# Altium schematic sheet TSAL_Control.SchDoc
size A4; SheetNumber: 1; SheetTotal: 1; SPICEModelCacheMUSAZMGH: <root> / <DocumentId>MUSAZMGH</DocumentId> / </root>
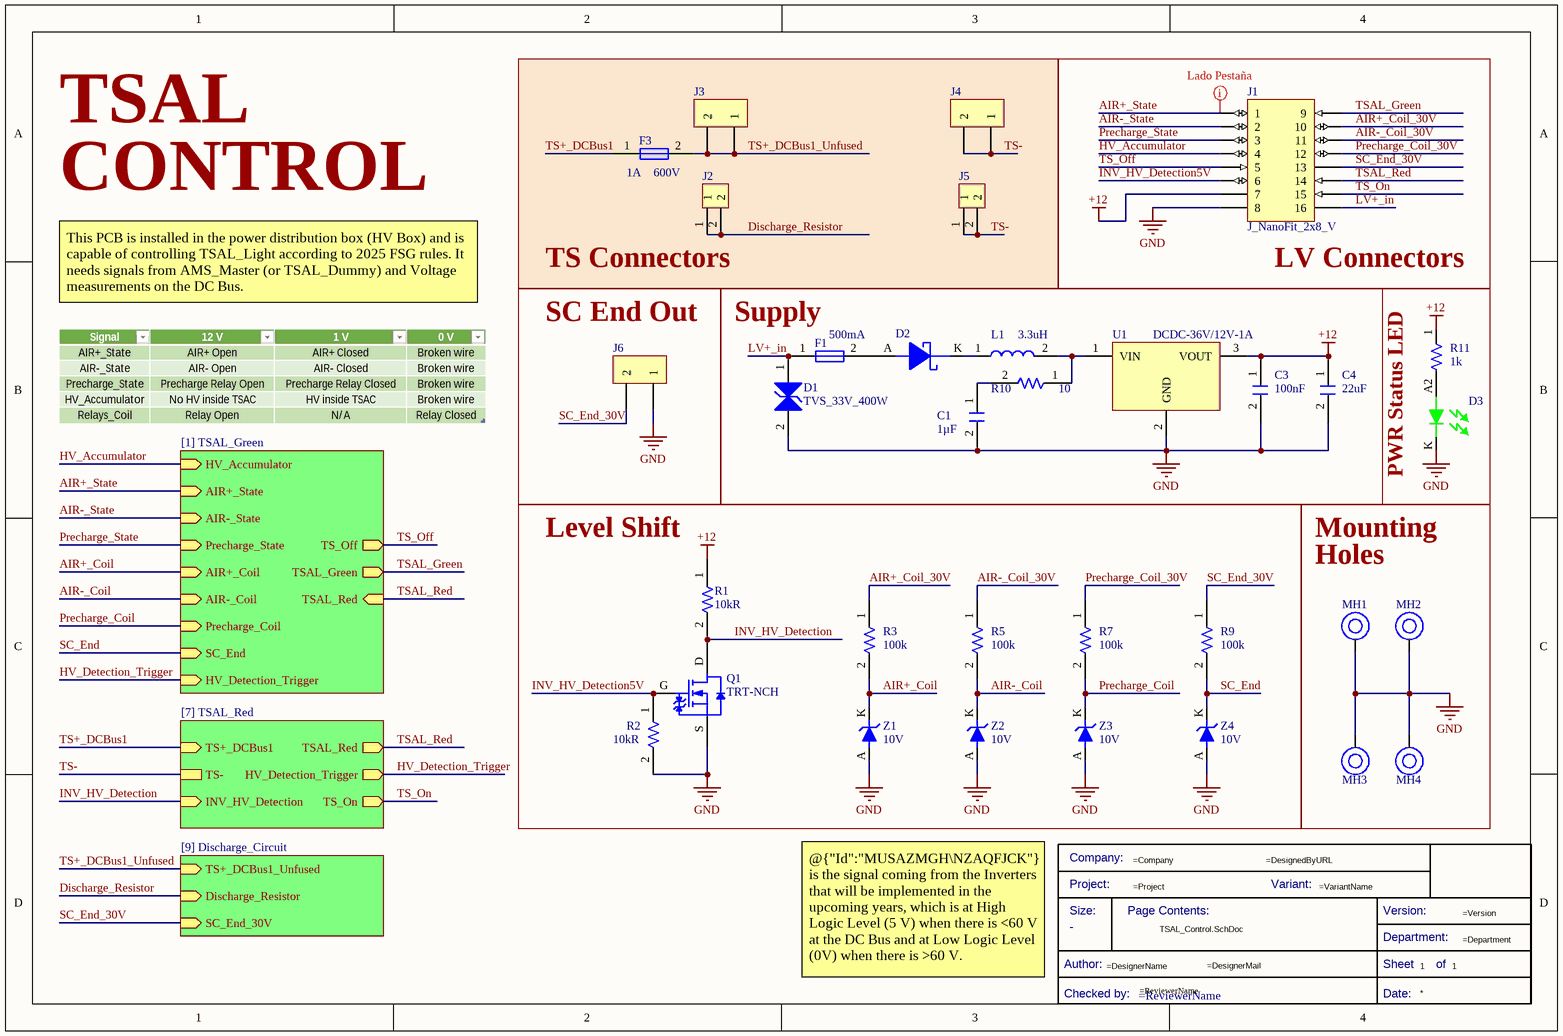
[diagram p0: TSAL_Control.SchDoc]

## Parts
*  Title Block_template  (value not drawn)  (graphical)
C1  value 1µF  [FP-CL31-IPC_A]  (hidden comment: C1u-50V-1206)
C3  value 100nF  [C1206FNPC-RW]  (hidden comment: C100n-25V-1206FNPC-X7R)
C4  Capacitance: 22uF  [WCAP-CSGP_1210_L3.2W2.5H2.5]  (hidden comment: C22u-25V-1210)
D1  TVS_33V_400W  [WE-TVSP_DO-214AC_Bidirectional]
D2  DSC-0.5/30-SOD123  [DSC-SOD123]  (value not drawn)
D3  LEDGS-0805-450  [LED_0805_WE]  (value not drawn)
F1  Current Rating: 500mA  [0805]  (hidden comment: MFU0805FF00500P500)
F3  Current Rating: 1A  Voltage Rating (DC): 600V  [Fuse_485001]  (hidden comment: Fuse_1A_600V)
J1  J_NanoFit_2x8_V  [J_NanoFit_2x8_V]
J2  J_MicroFit_2x1  [J_MicroFit_2x1]  (value not drawn)
J3  J_NanoFit_1x2  [FP-105309-1102-MFG]  (value not drawn)
J4  J_NanoFit_1x2  [FP-105309-1102-MFG]  (value not drawn)
J5  J_MicroFit_2x1  [J_MicroFit_2x1]  (value not drawn)
J6  J_NanoFit_1x2  [FP-105309-1102-MFG]  (value not drawn)
L1  3.3uH  [WE-PD_7345]
MH1  Mounting_Hole_M3  [Mounting_Hole_M3]  (value not drawn)
MH2  Mounting_Hole_M3  [Mounting_Hole_M3]  (value not drawn)
MH3  Mounting_Hole_M3  [Mounting_Hole_M3]  (value not drawn)
MH4  Mounting_Hole_M3  [Mounting_Hole_M3]  (value not drawn)
Q1  TRT-NCH  [TRT-NCH-3/35-CPH]
R1  10kR  [R0805FTK]
R2  value 10kR  [R0805FTK]  (hidden comment: R10k-0805FTK)
R3  value 100k  [RESC2013X70X40NL20T20]  (hidden comment: R100k-0805)
R5  value 100k  [RESC2013X70X40NL20T20]  (hidden comment: R100k-0805)
R7  value 100k  [RESC2013X70X40NL20T20]  (hidden comment: R100k-0805)
R9  value 100k  [RESC2013X70X40NL20T20]  (hidden comment: R100k-0805)
R10  Resistance: 10  [0805]  (hidden comment: R10_0805_0.25W)
R11  value 1k  [0805]  (hidden comment: R1K-0805-0.5W)
U1  DCDC-36V/12V-1A  [WPME-FDSM_SIP-3_L11.6W8H10.4]
Z1  Zener Voltage: 10V  [DSC-SOD123]  (hidden comment: DZ-10V/75-SOD-123)
Z2  Zener Voltage: 10V  [DSC-SOD123]  (hidden comment: DZ-10V/75-SOD-123)
Z3  Zener Voltage: 10V  [DSC-SOD123]  (hidden comment: DZ-10V/75-SOD-123)
Z4  Zener Voltage: 10V  [DSC-SOD123]  (hidden comment: DZ-10V/75-SOD-123)

## Blocks framed on the sheet
TS Connectors: F3 J2-J5
LV Connectors: J1
Supply: C1 C3 C4 D1 D2 F1 L1 R10 U1
PWR Status LED: D3 R11
Level Shift: Q1 R1-R3 R5 R7 R9 Z1-Z4

## Sub-sheets
Discharge_circuit = [9] Discharge_Circuit: Discharge_Resistor (in), SC_End_30V (in), TS+_DCBus1_Unfused (in)
TSAL Green = [1] TSAL_Green: HV_Accumulator (in), AIR+_State (in), Precharge_State (in), AIR+_Coil (in), AIR-_Coil (in), Precharge_Coil (in), SC_End (in), TS_Off (out), TSAL_Green (out), AIR-_State (in), HV_Detection_Trigger (in), TSAL_Red (in)
TSAL Red = [7] TSAL_Red: TS+_DCBus1 (in), TS_On (out), INV_HV_Detection (in), TSAL_Red (out), TS-, HV_Detection_Trigger (out)

## Nets
+12: C3.1 C4.1 J1.7 R1.1 R11.1 U1.3(VOUT)
GND: C1.2 C3.2 C4.2 D1.2 D3.K J1.8 J6.1 MH1.1 MH2.1 MH3.1 MH4.1 Q1.S R2.2 U1.2(GND) Z1.A Z2.A Z3.A Z4.A
AIR+_Coil: R3.2 Z1.K ; sheet TSAL Green/AIR+_Coil
AIR+_Coil_30V: J1.10 R3.1
AIR+_State: J1.1 ; sheet TSAL Green/AIR+_State
AIR-_Coil: R5.2 Z2.K ; sheet TSAL Green/AIR-_Coil
AIR-_Coil_30V: J1.11 R5.1
AIR-_State: J1.2 ; sheet TSAL Green/AIR-_State
Discharge_Resistor: J2.1 J2.2 ; sheet Discharge_circuit/Discharge_Resistor
HV_Accumulator: J1.4 ; sheet TSAL Green/HV_Accumulator
HV_Detection_Trigger: sheet TSAL Green/HV_Detection_Trigger, sheet TSAL Red/HV_Detection_Trigger
INV_HV_Detection: Q1.D R1.2 ; sheet TSAL Red/INV_HV_Detection
INV_HV_Detection5V: J1.6 Q1.G R2.1
LV+_in: D1.1 F1.1 J1.16
Precharge_Coil: R7.2 Z3.K ; sheet TSAL Green/Precharge_Coil
Precharge_Coil_30V: J1.12 R7.1
Precharge_State: J1.3 ; sheet TSAL Green/Precharge_State
SC_End: R9.2 Z4.K ; sheet TSAL Green/SC_End
SC_End_30V: J1.13 J6.2 R9.1 ; sheet Discharge_circuit/SC_End_30V
TS+_DCBus1: F3.1 ; sheet TSAL Red/TS+_DCBus1
TS+_DCBus1_Unfused: F3.2 J3.1 J3.2 ; sheet Discharge_circuit/TS+_DCBus1_Unfused
TS-: J4.1 J4.2 J5.1 J5.2 ; sheet TSAL Red/TS-
TS_Off: J1.5 ; sheet TSAL Green/TS_Off
TS_On: J1.15 ; sheet TSAL Red/TS_On
TSAL_Green: J1.9 ; sheet TSAL Green/TSAL_Green
TSAL_Red: J1.14 ; sheet TSAL Green/TSAL_Red, sheet TSAL Red/TSAL_Red
NetC1_1: C1.1 R10.2
NetD2_A: D2.A F1.2
NetD2_K: D2.K L1.1
NetD3_A: D3.A R11.2
NetL1_2: L1.2 R10.1 U1.1(VIN)

## Layout directives
mark named Lado Pestaña: AIR+_State

## Notes on the sheet
- TSAL
- CONTROL
- This PCB is installed in the power distribution box (HV Box) and is capable of controlling TSAL_Light according to 2025 FSG rules. It needs signals from AMS_Master (or TSAL_Dummy) and Voltage measurements on the DC Bus.
- SC End Out
- Mounting
- Holes
- (near *) @{"Id":"MUSAZMGH\NZAQFJCK"} is the signal coming from the Inverters that will be implemented in the upcoming years, which is at High Logic Level (5 V) when there is <60 V at the DC Bus and at Low Logic Level (0V) when there is >60 V.
- (in symbol CMP-00043-8) Company:; Project:; Variant:; Size:; Page Contents:; Version:; Department:; Author:; Sheet; of; Checked by:; Date:

## Library data of the parts
* = CMP-00043-8: Standard Title Block; .SCHcheck: GP; Checked by:: =ReviewerName; Size: -; Design Item ID: Title Block_template; .PCBcheck: GP; .Creator: GP; Source: e-Tech_Racing.SchLib; Category: Title Block
C1 = CMP-001-00031-2: Ceramic Capacitor, Multilayer, Ceramic, 50V, 10% +Tol, 10% -Tol, X7R, 15% TC, 1uF, Surface Mount, 1206, CL31B105KBHNNNE; Mounting Technology: Surface Mount; Min Operating Temperature: -55°C; Capacitor Type: Ceramic; Max Operating Temperature: 125°C; Case/Package: 1206; Pins: 2; RoHS Compliant: Yes
C3 = CMP-00062-3: Cap Cer 0.1UF 25V X7R 1206; Manufacturer: Wurth Electronics; Manufacturer Part Number: 885012208058; .Creator: DO; Tolerance: 10%; ComponentLink2Description: Where buy it; ComponentLink1URL: https://www.we-online.com/catalog/datasheet/885012208058.pdf; Packaging: Tape and Reel; Voltage Rating: 25V; Source: Passives.SchLib; Width: 0.063inch; Case Code (Metric): 3216; Case/Package: 1206; RoHS Compliant: Yes; Category: Capacitor; Pricing 1: 1=0,11000, 10=0,10100, 100=0,09100, 500=0,08000 (USD); Stock 1: 4375; ComponentLink2URL: https://www.we-online.com/catalog/en/WCAP-CSGP-25VDC#885012208058; Mount: Surface Mount; Min Operating Temperature: -55°C; ComponentLink1Description: Datasheet; ComponentLink3Description: https://katalog.we-online.de/pbs/datasheet/885012208058.pdf?src-supplier=Digi-Key; Max Operating Temperature: 125°C; Design Item ID: C100n-25V-1206FNPC-X7R; Thickness: 0.035inch; Length: 0.126inch; ComponentLink3URL: https://katalog.we-online.de/pbs/datasheet/885012208058.pdf?src-supplier=Digi-Key; RoHS: Yes
C4 = CMP-001-00030-1: Cap, 22Uf, 25V, Mlcc, 1210 Rohs Compliant: Yes
D1 = CMP-004-00003-1: Trans Voltage Suppressor Diode, 400W, Bidirectional, 1 Element, Silicon, DO-214AC; Min Operating Temperature: -65°C; Pins: 2; RoHS Compliant: Yes; Max Operating Temperature: 150°C
D2 = CMP-00165-2: VR=30V IF=500mA 30pF P=410mW; Max Reverse Leakage Current: 130uA; .Creator: GP; Max Reverse Voltage (DC): 30V; Element Configuration: Single; Average Rectified Current: 500mA; Peak Non-Repetitive Surge Current: 5.5A; Polarity: Standard; Forward Voltage: 430mV; ComponentLink10Description: https://datasheet.ciiva.com/910/mbr0530-910518.pdf?src-supplier=Digi-Key; ComponentLink1Description: Datasheet; Category: Diode; ComponentLink3Description: https://datasheet.ciiva.com/30479/0900766b810e2512-30479401.pdf?src-supplier=RSComponents; ComponentLink5Description: https://datasheet.ciiva.com/910/mbr0530-910516.pdf?src-supplier=Digi-Key; Stock 1: 9; Weight: 0.03g; Source: Filter components.SchLib; ComponentLink2Description: Where buy it; Series: -; Mount: Surface Mount; Max Repetitive Reverse Voltage (Vrrm): 30V; Pricing 1: 1=0,34400, 10=0,23900, 100=0,12200, 500=0,10000 (USD); Design Item ID: DSC-0.5/30-SOD123; ComponentLink8Description: https://datasheet.ciiva.com/17318/mbr0530-17318568.pdf?src-supplier=Future+Electronics; Current Rating: 500mA; ComponentLink1URL: *; Length: 2.7mm; Max Reverse Current: 130uA; ComponentLink7URL: https://datasheet.ciiva.com/8300/mbr0530-8300905.pdf?src-supplier=Avnet; ComponentLink9URL: https://datasheet.ciiva.com/15144/getdatasheetpartid-86760-15144598.pdf?src-supplier=Verical; Radiation Hardening: No; Height: 1.03mm; ComponentLink4Description: https://datasheet.ciiva.com/34301/974753-34301826.pdf?src-supplier=Jameco; ComponentLink7Description: https://datasheet.ciiva.com/8300/mbr0530-8300905.pdf?src-supplier=Avnet; Package Quantity: 1; Forward Current: 500mA; ComponentLink5URL: https://datasheet.ciiva.com/910/mbr0530-910516.pdf?src-supplier=Digi-Key; Max Surge Current: 5.5A; Lead Free: Lead Free; ComponentLink2URL: *; Max Forward Surge Current (Ifsm): 5.5A; Output Current: 500mA; Voltage Rating (DC): 30V; Contact Plating: Tin,Matte; RoHS Compliant: Yes; REACH SVHC: No SVHC; ComponentLink10URL: https://datasheet.ciiva.com/910/mbr0530-910518.pdf?src-supplier=Digi-Key; ComponentLink4URL: https://datasheet.ciiva.com/34301/974753-34301826.pdf?src-supplier=Jameco; ComponentLink6URL: https://datasheet.ciiva.com/25931/mbr0530-25931989.pdf?src-supplier=Avnet+Europe; ComponentLink6Description: https://datasheet.ciiva.com/25931/mbr0530-25931989.pdf?src-supplier=Avnet+Europe; Width: 1.6mm; ComponentLink3URL: https://datasheet.ciiva.com/30479/0900766b810e2512-30479401.pdf?src-supplier=RSComponents; ComponentLink9Description: https://datasheet.ciiva.com/15144/getdatasheetpartid-86760-15144598.pdf?src-supplier=Verical; ComponentLink8URL: https://datasheet.ciiva.com/17318/mbr0530-17318568.pdf?src-supplier=Future+Electronics
D3 = CMP-00131-3: Led, Green, 520 Nm, 3.2 V, 30 Ma, 450 Mcd Rohs Compliant: Yes; Manufacturer 1: Wurth Electronics; Manufacturer Part Number 1: 150080GS75000; Luminous Intensity: 450mcd; Wavelength: 520nm; Viewing Angle: 140°; Forward Current: 30mA; Lens Style: Clear,Rectangular; Forward Voltage: 3.2V; Test Current: 20mA; .Creator: GP; Case Code (Imperial): 0805; ComponentLink2Description: Where buy it; REACH SVHC: Unknown; Case Code (Metric): 2012; Max Operating Temperature: 85°C; Length: 2mm; ComponentLink2URL: https://katalog.we-online.de/en/led/WL-SMCW/150080GS75000; ComponentLink1Description: Datasheet; Case/Package: 0805; ComponentLink3Description: https://datasheet.ciiva.com/29563/150080gs75000-29563008.pdf?src-supplier=Digi-Key; RoHS: Yes; Stock 1: 4350; ComponentLink3URL: https://datasheet.ciiva.com/29563/150080gs75000-29563008.pdf?src-supplier=Digi-Key; Category: LEDs; Min Operating Temperature: -40°C; Height: 0.7mm; Packaging: Cut Tape; Pricing 1: 50=0,19300, 500=0,12900, 1000=0,12300, 2000=0,11700, 4000=0,11100 (USD); ComponentLink4URL: https://datasheet.ciiva.com/29279/759434-da-01-en-chipled-0805-w-kl-gruen-150080gs75000-29279039.pdf?src-supplier=Conrad; Mount: Surface Mount; RoHS Compliant: Yes; Color: Green; ComponentLink4Description: https://datasheet.ciiva.com/29279/759434-da-01-en-chipled-0805-w-kl-gruen-150080gs75000-29279039.pdf?src-supplier=Conrad; Design Item ID: LEDGS-0805-450; Package Quantity: 4000; Source: Semiconductor.SchLib; Width: 1.25mm; Dominant Wavelength: 520nm; ComponentLink1URL: https://www.we-online.com/catalog/datasheet/150080GS75000.pdf
F1 = CMP-001-00020-3: Fuse, 24 Milliohms to 660 Milliohms (Cold) @ 0.1, 32 V, 0805, 15 C, 35 C; Value: 0.5A-50V; Max Operating Temperature: 125°C; Pins: 2; Case/Package: 0805; Mounting Technology: Surface Mount,PCB; RoHS Compliant: Yes; Min Operating Temperature: 15°C
F3 = CMP-00161-2: Surface Mount Fuses 600V 1A Fast Acting; Manufacturer Part Number 1: 0485001.DR; Manufacturer 1: Littelfuse; .Creator: DO; Voltage Rating (AC): 250V; Approvals: UL,CSA; Fuse Type: Board Mount (Cartridge Style Excluded); Resistance: 0.264; DC Cold Resistance: 304.4mR; Body Material: Ceramic; Max Operating Temperature: 125°C; Pricing 1: 1=2,82900, 5=2,81400, 10=2,75200, 50=2,59800, 100=2,40300, 250=2,37900, 500=2,30400, 1500=2,24900, 3000=2,11600 (USD); Min Operating Temperature: -55°C; ComponentLink5Description: http://www.littelfuse.com/~/media/Files/Littelfuse/Technical%20Resources/Documents/Data%20Sheets/Littelfuse_Fuse_485_Datasheet.pdf?src-supplier=Element14; Length: 12.1mm; Case/Package: SMD/SMT; Housing Material: Ceramic; REACH SVHC: No SVHC; Category: Fuses; Mount: Surface Mount; Lead Free: Lead Free; Voltage Rating: 600V; ComponentLink1URL: http://www.farnell.com/datasheets/1945989.pdf?src-supplier=Farnell; RoHS Compliant: Yes; Height: 0.177inch; Stock 1: 4123; Series: 485; ComponentLink6Description: http://www.littelfuse.com/~/media/electronics/datasheets/fuses/littelfuse_fuse_485_datasheet.pdf.pdf?src-supplier=Digi-Key; ComponentLink4Description: http://components.arrow.com/part/dataview/56707787S790276N3675?src-supplier=Arrow+Electronics; ComponentLink5URL: http://www.littelfuse.com/~/media/Files/Littelfuse/Technical%20Resources/Documents/Data%20Sheets/Littelfuse_Fuse_485_Datasheet.pdf?src-supplier=Element14; ComponentLink1Description: http://www.farnell.com/datasheets/1945989.pdf?src-supplier=Farnell; ComponentLink2URL: http://www.farnell.com/datasheets/2282568.pdf?src-supplier=Farnell; Termination: SMD/SMT; ComponentLink3URL: http://www.mouser.com/ds/2/240/Littelfuse485_datasheet_080512-201879.pdf?src-supplier=Mouser; Source: Filter components.SchLib; Depth: 4.5mm; Package Quantity: 1; ComponentLink3Description: http://www.mouser.com/ds/2/240/Littelfuse485_datasheet_080512-201879.pdf?src-supplier=Mouser; ComponentLink6URL: http://www.littelfuse.com/~/media/electronics/datasheets/fuses/littelfuse_fuse_485_datasheet.pdf.pdf?src-supplier=Digi-Key; RoHS: Yes; Design Item ID: Fuse_1A_600V; Fuse Current: 1A; Width: 0.177inch; ComponentLink2Description: http://www.farnell.com/datasheets/2282568.pdf?src-supplier=Farnell; Packaging: Tape and Reel; ComponentLink4URL: http://components.arrow.com/part/dataview/56707787S790276N3675?src-supplier=Arrow+Electronics
J1 = CMP-00020-3: Nano-Fit Vertical Header Through Hole 2.50mm Pitch Dual Row 16 Circuits with Kinked Pins Tin (Sn) Plating Black; Manufacturer 1: Molex; Manufacturer Part Number 1: 105310-1116; Connector Type: Header,Male Pin; Number of Positions: 16; .Creator: AC; Fastening Type: Latch; Contact Shape: Square; Mount: Through Hole; Stock 1: 84; ComponentLink2Description: Molex; Source: Electromechanical.SchLib; RoHS: No; Min Operating Temperature: -40°C; Number of Rows: 2; Termination: Kinked Pin; ComponentLink1Description: https://www.molex.com/pdm_docs/sd/1053101210_sd.pdf?src-supplier=Digi-Key; ComponentLink2URL: https://www.molex.com/molex/products/part-detail/pcb_headers/1053101116; Contact Plating: Tin; Insulation Color: Black; Insulation Material: Polymer; Contact Material: Brass; Max Operating Temperature: 105°C; Pricing 1: 1=3,21000, 10=2,82400, 84=2,24619, 1008=1,86110, 4956=1,66858 (USD); Packaging: Tray; ComponentLink1URL: https://www.molex.com/pdm_docs/sd/1053101210_sd.pdf?src-supplier=Digi-Key; Category: Headers and Wire Housings; Design Item ID: J_NanoFit_2x8_V
J2 J5 = CMP-00012-1: Header 1 Row Vertical Polarizing Peg 2 Pin SMT/Glow Wire Compatible Tin Plate; Manufacturer 1: Molex; Manufacturer Part Number 1: 43650-0215; ComponentLink6Description: https://datasheet.ciiva.com/7920/1889390-7920892.pdf?src-supplier=Element14; ComponentLink2Description: https://datasheet.ciiva.com/5157/0436500215-pcb-headers-148687-5157608.pdf?src-supplier=Mouser; ComponentLink3Description: https://datasheet.ciiva.com/16085/0436500215-pcb-headers-16085668.pdf?src-supplier=Onlinecomponents.com; ComponentLink3URL: https://datasheet.ciiva.com/16085/0436500215-pcb-headers-16085668.pdf?src-supplier=Onlinecomponents.com; ComponentLink1URL: https://datasheet.ciiva.com/19462/884109-19462034.pdf?src-supplier=Jameco; ComponentLink4Description: https://datasheet.ciiva.com/11748/0900766b80307ce2-11748388.pdf?src-supplier=RSComponents; RoHS: Yes; Design Item ID: J_MicroFit_2x1; ComponentLink6URL: https://datasheet.ciiva.com/7920/1889390-7920892.pdf?src-supplier=Element14; Stock 1: 11086; ComponentLink2URL: https://datasheet.ciiva.com/5157/0436500215-pcb-headers-148687-5157608.pdf?src-supplier=Mouser; ComponentLink1Description: https://datasheet.ciiva.com/19462/884109-19462034.pdf?src-supplier=Jameco; Category: Headers and Wire Housings; ComponentLink5URL: https://datasheet.ciiva.com/9432/0436500215-pcb-headers-9432850.pdf?src-supplier=Avnet; ComponentLink5Description: https://datasheet.ciiva.com/9432/0436500215-pcb-headers-9432850.pdf?src-supplier=Avnet; ComponentLink4URL: https://datasheet.ciiva.com/11748/0900766b80307ce2-11748388.pdf?src-supplier=RSComponents; Pricing 1: 1=0,87800, 10=0,74400, 80=0,63070, 3264=0,47000, 6528=0,45100, 13056=0,41760 (USD); Source: Electromechanical.SchLib
J3 J4 J6 = CMP-002-00001-2: Conn HDR 2 POS 2.5mm Solder ST Thru-Hole 2 Terminal 1 Port Nano-Fit Tray
L1 = CMP-006-00002-2: General Purpose Inductor, 3.3uH, 20%, 1 Element, Ferrite-Core, SMD. 744777003; Max Current Rating: 5A; Self Resonant Frequency: 55MHz; Max Operating Temperature: 125°C; RoHS Compliant: Yes; Pins: 2; Tolerance: 20%; Min Operating Temperature: -40°C
MH1-MH4 = CMP-00040-2: Source: Electromechanical.SchLib; Design Item ID: Mounting_Hole_M3
Q1 = CMP-00142-1: Automotive N-channel 40 V (d-s) 175C Mosfet SOT-23; Manufacturer Part Number 1: SQ2318BES-T1_GE3; Manufacturer 1: Vishay; Vds: 40V; .Creator: DO; Pricing 1: 1=0,71500, 5=0,71500, 10=0,64400, 25=0,59000, 50=0,52500, 100=0,47100, 250=0,40800 (USD); RoHS: No; ComponentLink2Description: Datasheet; ComponentLink1Description: Where to buy; Design Item ID: TRT-NCH-8/40-SQ; Source: Semiconductor.SchLib; ComponentLink2URL: https://www.mouser.es/datasheet/2/427/sq2318bes-1868475.pdf; ComponentLink1URL: https://www.mouser.es/ProductDetail/Vishay-Siliconix/SQ2318BES-T1_GE3?qs=sPbYRqrBIVmyZcxPsDt0vA%3D%3D
R1 = CMP-00085-4: BOURNS         CR0805-JW-103ELF            Surface Mount Chip Resistor, Thick Film, CR Series, 10 kohm, 125 mW,  5%, 150 V; Voltage Rating: 150V; Voltage Rating (DC): 100V; Max Power Dissipation: 125mW; Temperature Coefficient: 200ppm/°C; Value: 10k; .Creator: DR; Depth: 1.25mm; Package Quantity: 1; ComponentLink6Description: https://datasheet.ciiva.com/16783/70154685-16783482.pdf?src-supplier=Allied+Electronics; Max Operating Temperature: 155°C; ComponentLink8Description: https://datasheet.ciiva.com/6559/chpreztr-6559900.pdf?src-supplier=Digi-Key; ComponentLink3URL: https://datasheet.ciiva.com/22693/1902866-22693254.pdf?src-supplier=Element14; ComponentLink2URL: https://datasheet.ciiva.com/9122/chpreztr-9122374.pdf?src-supplier=Avnet; REACH SVHC: No SVHC; ComponentLink9Description: https://datasheet.ciiva.com/6559/chpreztr-6559901.pdf?src-supplier=Digi-Key; ComponentLink1URL: https://datasheet.ciiva.com/11821/0900766b80fcdb72-11821135.pdf?src-supplier=RSComponents; Manufacturer Part Number 1: CR0805-JW-103ELF; ComponentLink8URL: https://datasheet.ciiva.com/6559/chpreztr-6559900.pdf?src-supplier=Digi-Key; Length: 2mm; ComponentLink10Description: https://datasheet.ciiva.com/7985/1856384-7985869.pdf?src-supplier=Element14; Case/Package: 0805; ComponentLink5Description: https://datasheet.ciiva.com/30065/159chpreztr-30065976.pdf?src-supplier=Onlinecomponents.com; Design Item ID: R10k-0805FTK; ComponentLink1Description: https://datasheet.ciiva.com/11821/0900766b80fcdb72-11821135.pdf?src-supplier=RSComponents; Number of Terminations: 2; Radiation Hardening: No; Resistance Tolerance: 5%; ComponentLink4Description: https://datasheet.ciiva.com/7986/691949-7986187.pdf?src-supplier=Element14; ComponentLink3Description: https://datasheet.ciiva.com/22693/1902866-22693254.pdf?src-supplier=Element14; Packaging: Tape and Reel; ComponentLink6URL: https://datasheet.ciiva.com/16783/70154685-16783482.pdf?src-supplier=Allied+Electronics; Pins: 2; ComponentLink5URL: https://datasheet.ciiva.com/30065/159chpreztr-30065976.pdf?src-supplier=Onlinecomponents.com; Mount: Surface Mount; ComponentLink11URL: https://datasheet.ciiva.com/48692/001055517-da-01-en-smd-wid-cr0805-jw-103elf-10k-ohm-1-8w-48692118.pdf?src-supplier=Conrad; ComponentLink11Description: https://datasheet.ciiva.com/48692/001055517-da-01-en-smd-wid-cr0805-jw-103elf-10k-ohm-1-8w-48692118.pdf?src-supplier=Conrad; Military Standard: Not; Power Rating: 125mW; Thickness: 508um; Source: Passives.SchLib; Min Operating Temperature: -55°C; Manufacturer 1: Bourns; Resistor Type: Thick Film; ComponentLink7URL: https://datasheet.ciiva.com/5548/chpreztr-5548491.pdf?src-supplier=Mouser; ComponentLink2Description: https://datasheet.ciiva.com/9122/chpreztr-9122374.pdf?src-supplier=Avnet; Termination: SMD/SMT; Features: Moisture Resistant; ComponentLink4URL: https://datasheet.ciiva.com/7986/691949-7986187.pdf?src-supplier=Element14; RoHS Compliant: Yes; ComponentLink9URL: https://datasheet.ciiva.com/6559/chpreztr-6559901.pdf?src-supplier=Digi-Key; Technology: THICK FILM; ComponentLink10URL: https://datasheet.ciiva.com/7985/1856384-7985869.pdf?src-supplier=Element14; Height: 0.5mm; Category: Chip SMD Resistors; RoHS: Yes; Series: CR0805; Pricing 1: 1=0,05790, 10=0,01540, 25=0,01340, 100=0,00340 (USD); Stock 1: 57566; ComponentLink7Description: https://datasheet.ciiva.com/5548/chpreztr-5548491.pdf?src-supplier=Mouser; Case Code (Metric): 2012; Contact Plating: Tin; Tolerance: 5%; Construction: Rectangular; Width: 1.25mm
R2 = CMP-00085-4: BOURNS         CR0805-JW-103ELF            Surface Mount Chip Resistor, Thick Film, CR Series, 10 kohm, 125 mW,  5%, 150 V; Voltage Rating: 150V; Voltage Rating (DC): 100V; Max Power Dissipation: 125mW; Temperature Coefficient: 200ppm/°C; .Creator: DR; Depth: 1.25mm; Package Quantity: 1; ComponentLink6Description: https://datasheet.ciiva.com/16783/70154685-16783482.pdf?src-supplier=Allied+Electronics; Max Operating Temperature: 155°C; ComponentLink8Description: https://datasheet.ciiva.com/6559/chpreztr-6559900.pdf?src-supplier=Digi-Key; ComponentLink3URL: https://datasheet.ciiva.com/22693/1902866-22693254.pdf?src-supplier=Element14; ComponentLink2URL: https://datasheet.ciiva.com/9122/chpreztr-9122374.pdf?src-supplier=Avnet; REACH SVHC: No SVHC; ComponentLink9Description: https://datasheet.ciiva.com/6559/chpreztr-6559901.pdf?src-supplier=Digi-Key; ComponentLink1URL: https://datasheet.ciiva.com/11821/0900766b80fcdb72-11821135.pdf?src-supplier=RSComponents; Manufacturer Part Number 1: CR0805-JW-103ELF; ComponentLink8URL: https://datasheet.ciiva.com/6559/chpreztr-6559900.pdf?src-supplier=Digi-Key; Length: 2mm; ComponentLink10Description: https://datasheet.ciiva.com/7985/1856384-7985869.pdf?src-supplier=Element14; Case/Package: 0805; ComponentLink5Description: https://datasheet.ciiva.com/30065/159chpreztr-30065976.pdf?src-supplier=Onlinecomponents.com; Design Item ID: R10k-0805FTK; ComponentLink1Description: https://datasheet.ciiva.com/11821/0900766b80fcdb72-11821135.pdf?src-supplier=RSComponents; Number of Terminations: 2; Radiation Hardening: No; Resistance Tolerance: 5%; ComponentLink4Description: https://datasheet.ciiva.com/7986/691949-7986187.pdf?src-supplier=Element14; ComponentLink3Description: https://datasheet.ciiva.com/22693/1902866-22693254.pdf?src-supplier=Element14; Packaging: Tape and Reel; ComponentLink6URL: https://datasheet.ciiva.com/16783/70154685-16783482.pdf?src-supplier=Allied+Electronics; Pins: 2; ComponentLink5URL: https://datasheet.ciiva.com/30065/159chpreztr-30065976.pdf?src-supplier=Onlinecomponents.com; Mount: Surface Mount; ComponentLink11URL: https://datasheet.ciiva.com/48692/001055517-da-01-en-smd-wid-cr0805-jw-103elf-10k-ohm-1-8w-48692118.pdf?src-supplier=Conrad; ComponentLink11Description: https://datasheet.ciiva.com/48692/001055517-da-01-en-smd-wid-cr0805-jw-103elf-10k-ohm-1-8w-48692118.pdf?src-supplier=Conrad; Military Standard: Not; Power Rating: 125mW; Thickness: 508um; Source: Passives.SchLib; Min Operating Temperature: -55°C; Manufacturer 1: Bourns; Resistor Type: Thick Film; ComponentLink7URL: https://datasheet.ciiva.com/5548/chpreztr-5548491.pdf?src-supplier=Mouser; ComponentLink2Description: https://datasheet.ciiva.com/9122/chpreztr-9122374.pdf?src-supplier=Avnet; Termination: SMD/SMT; Features: Moisture Resistant; ComponentLink4URL: https://datasheet.ciiva.com/7986/691949-7986187.pdf?src-supplier=Element14; RoHS Compliant: Yes; ComponentLink9URL: https://datasheet.ciiva.com/6559/chpreztr-6559901.pdf?src-supplier=Digi-Key; Technology: THICK FILM; ComponentLink10URL: https://datasheet.ciiva.com/7985/1856384-7985869.pdf?src-supplier=Element14; Height: 0.5mm; Category: Chip SMD Resistors; RoHS: Yes; Series: CR0805; Pricing 1: 1=0,05790, 10=0,01540, 25=0,01340, 100=0,00340 (USD); Stock 1: 57566; ComponentLink7Description: https://datasheet.ciiva.com/5548/chpreztr-5548491.pdf?src-supplier=Mouser; Case Code (Metric): 2012; Contact Plating: Tin; Tolerance: 5%; Construction: Rectangular; Width: 1.25mm
R3 R5 R7 R9 = CMP-009-00003-4: Fixed Resistor, Metal Glaze/thick Film, 0.125W, 100000ohm, 150V, 5% +/-Tol, 200ppm/Cel, Surface Mount, 0805; Power: 125mW; Min Operating Temperature: -55°C; Mounting Technology: Surface Mount; Tolerance: 5%; Case/Package: 0805; Pins: 2; Max Operating Temperature: 155°C; RoHS Compliant: Yes
R10 = CMP-009-00034-5: Res, 10R, 5%, 0.25W, Thick Film, 0805;
R11 = CMP-009-00043-2: Fixed Resistor, Metal Glaze/thick Film, 0.5W, 1000ohm, 150V, 1% +/-Tol, 100ppm/Cel, Surface Mount, 0805; Power: 500mW; Pins: 2; RoHS Compliant: Yes; Tolerance: 1%; Case/Package: 0805; Min Operating Temperature: -55°C; Mounting Technology: Surface Mount; Max Operating Temperature: 155°C
U1 = CMP-019-00006-2: Switching Regulator 36V In / 12 V Out, 1A. 173011235; RoHS Compliant: Yes
Z1-Z4 = CMP-00159-3: Diode Zener Single 10V 2% 500mW 2-Pin SOD-123 T/R; Manufacturer Part Number: MMSZ5240C-HE3-08; Manufacturer: Vishay; Max Reverse Leakage Current: 3uA; .Creator: DO; Impedance: 17R; Zener Current: 20mA; Element Configuration: Single; RoHS: Yes; Pins: 2; Voltage Tolerance: 2%; Power Dissipation: 500mW; ComponentLink2URL: http://components.arrow.com/part/dataview/59571956S617370N5680?src-supplier=Arrow+Electronics; ComponentLink1Description: http://www.mouser.com/ds/2/427/mmsz5225-102133.pdf?src-supplier=Mouser; Mount: Surface Mount; Case/Package: 3000; Category: Zener Diodes; Packaging: Tape and Reel; Tolerance: 2%; ComponentLink3Description: http://www.vishay.com/docs/85774/mmsz5225.pdf?src-supplier=Digi-Key; Max Operating Temperature: 150°C; ComponentLink2Description: http://components.arrow.com/part/dataview/59571956S617370N5680?src-supplier=Arrow+Electronics; Min Operating Temperature: -55°C; ComponentLink4URL: https://www.mouser.es/ProductDetail/Vishay-Semiconductors/MMSZ5240C-HE3-08?qs=ESFF34UzhwiGAVchySN1uQ%3D%3D; ComponentLink1URL: http://www.mouser.com/ds/2/427/mmsz5225-102133.pdf?src-supplier=Mouser; Design Item ID: DZ-0.01/75-SOD-123; ComponentLink3URL: http://www.vishay.com/docs/85774/mmsz5225.pdf?src-supplier=Digi-Key; RoHS Compliant: Yes; Stock 1: 4964; Max Power Dissipation: 500mW; ComponentLink4Description: Where buy it; Weight: 0.000363oz; Pricing 1: 1=0,36000, 10=0,29800, 50=0,29800, 100=0,15800, 1000=0,07100, 10000=0,04700 (USD); Source: Filter components.SchLib